# EAGLE design Laskuri (EAGLE 9.5.1)
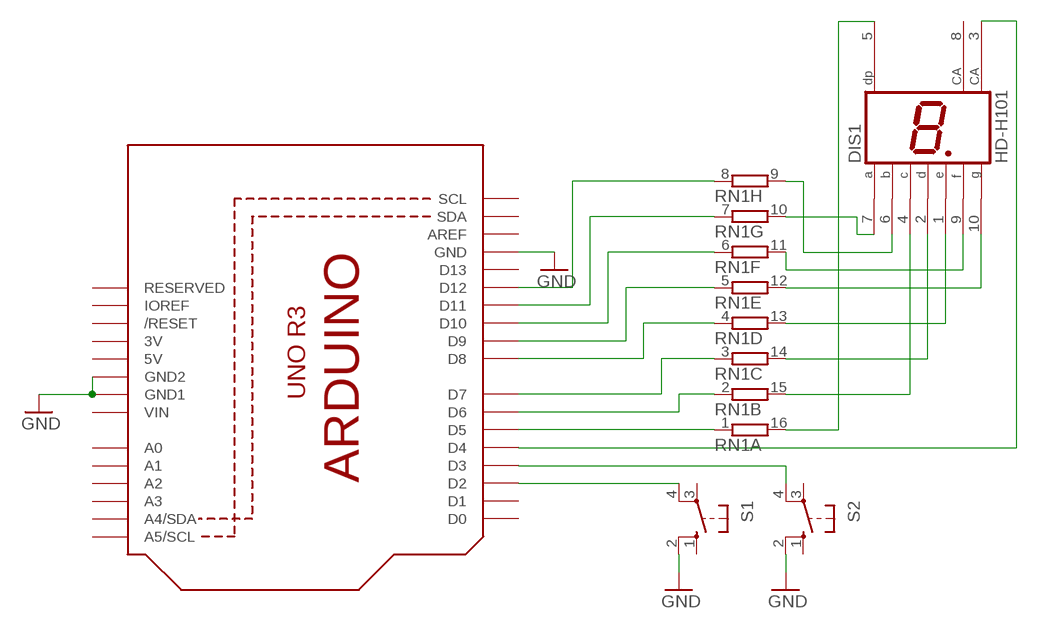
[diagram p0: schematic, sheet 1]

## Parts
DIS1  HD-H101  [HDSP-M]
RN1  8R-N  [DIL16]
S1  10-XX  [B3F-10XX]
S2  10-XX  [B3F-10XX]
U1  ARDUINOR3-DIMENSION  [ARDUINOR3]

## Nets
GND: S1.2(S1) S2.2(S1) U1.GND U1.GND1 U1.GND2
N$1: RN1.8 U1.D12
N$2: RN1.7 U1.D11
N$3: RN1.6 U1.D10
N$4: RN1.5 U1.D9
N$5: RN1.4 U1.D8
N$6: RN1.3 U1.D7
N$7: RN1.2 U1.D6
N$8: RN1.1 U1.D5
N$9: DIS1.1(E) RN1.13
N$10: S1.4(P1) U1.D2
N$11: S2.4(P1) U1.D3
N$12: DIS1.2(D) RN1.14
N$13: DIS1.4(C) RN1.15
N$14: DIS1.5(DP) RN1.16
N$15: DIS1.10(G) RN1.12
N$16: DIS1.9(F) RN1.11
N$17: DIS1.7(A) RN1.10
N$18: DIS1.6(B) RN1.9
N$19: DIS1.3(CA) U1.D4
Unconnected: DIS1.8(CA) S1.1(S) S1.3(P) S2.1(S) S2.3(P) U1.A0 U1.A1 U1.A2 U1.A3 U1.A4(A4/SDA) U1.A5(A5/SCL) U1.AREF U1.D0 U1.D1 U1.D13 U1.IOREF U1.RESERVED U1.RESET(/RESET) U1.SCL U1.SDA

## Power pins joined to a net without a drawn wire
3V: U1.3V
5V: U1.5V
VIN: U1.VIN

## Library data of the parts
DIS1 = display-hp:HD-H101: LED DISPLAY 1-character 7 segment, decimal point right; OC_FARNELL: unknown; OC_NEWARK: unknown
RN1 = resistor-dil:8R-N: DIL RESISTOR; OC_FARNELL: unknown; OC_NEWARK: unknown
S1 S2 = switch-omron:10-XX: OMRON SWITCH; MPN: B3F-1000; OC_FARNELL: 176432; OC_NEWARK: 36M3542
U1 = adafruit:ARDUINOR3: This is a new object for the new Arduino R3 - with extra pins that you may want to use (such as IOref, and duplicated A4/A5

## Net classes
0 default: width 1.016 mm, clearance 0.381 mm

## Board
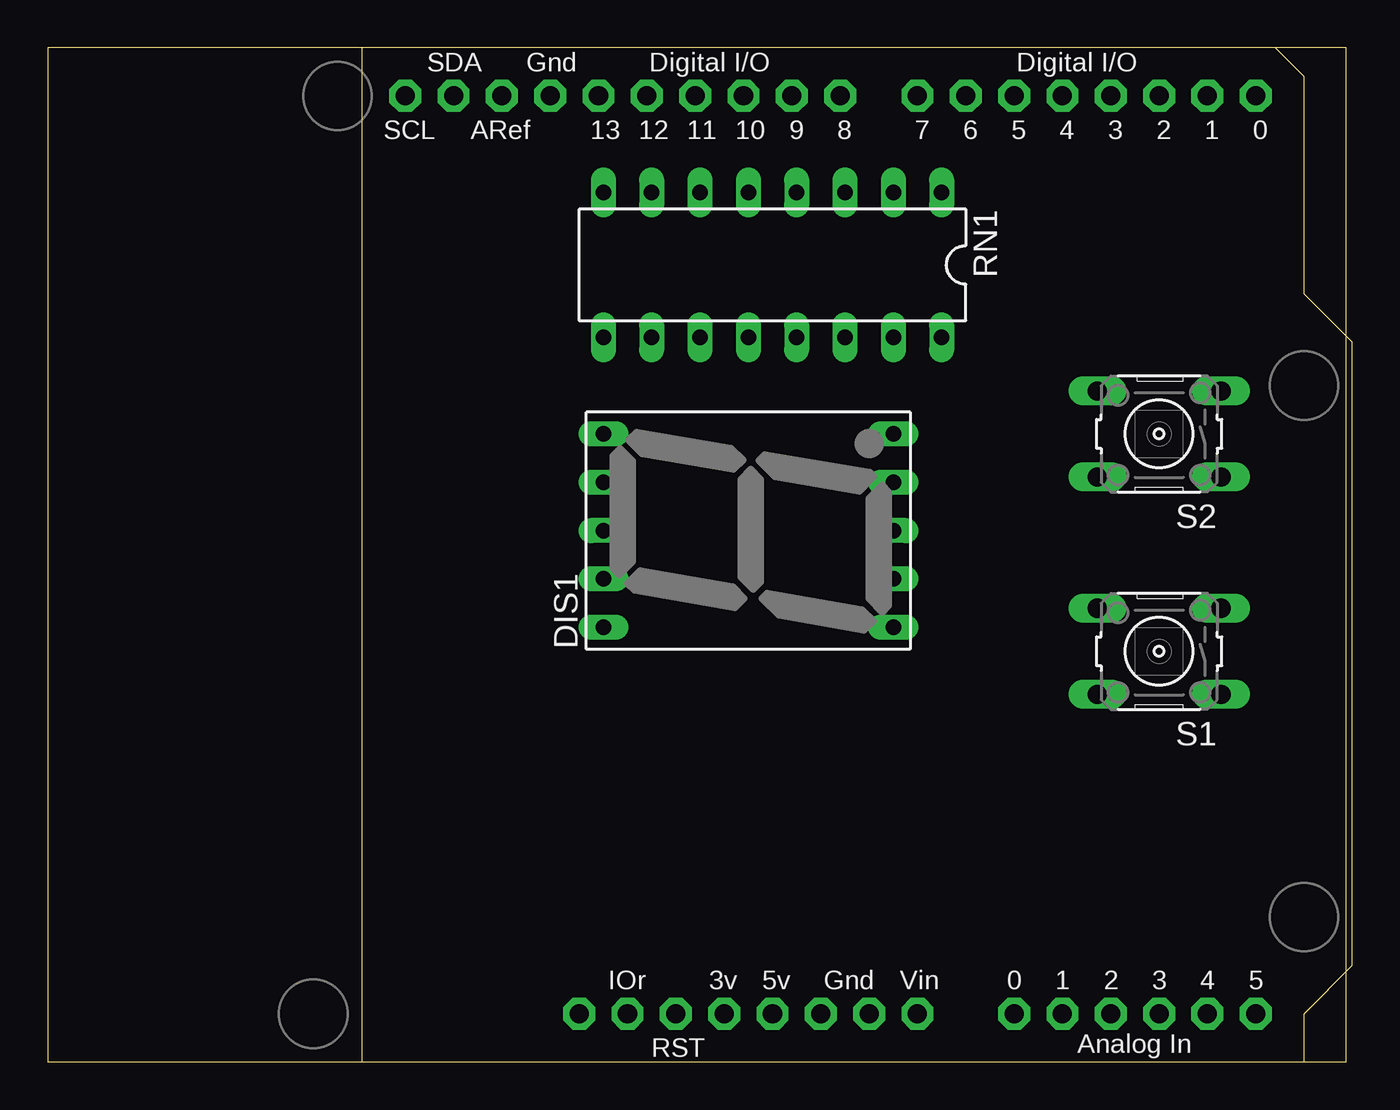
[diagram p1: board, top side]
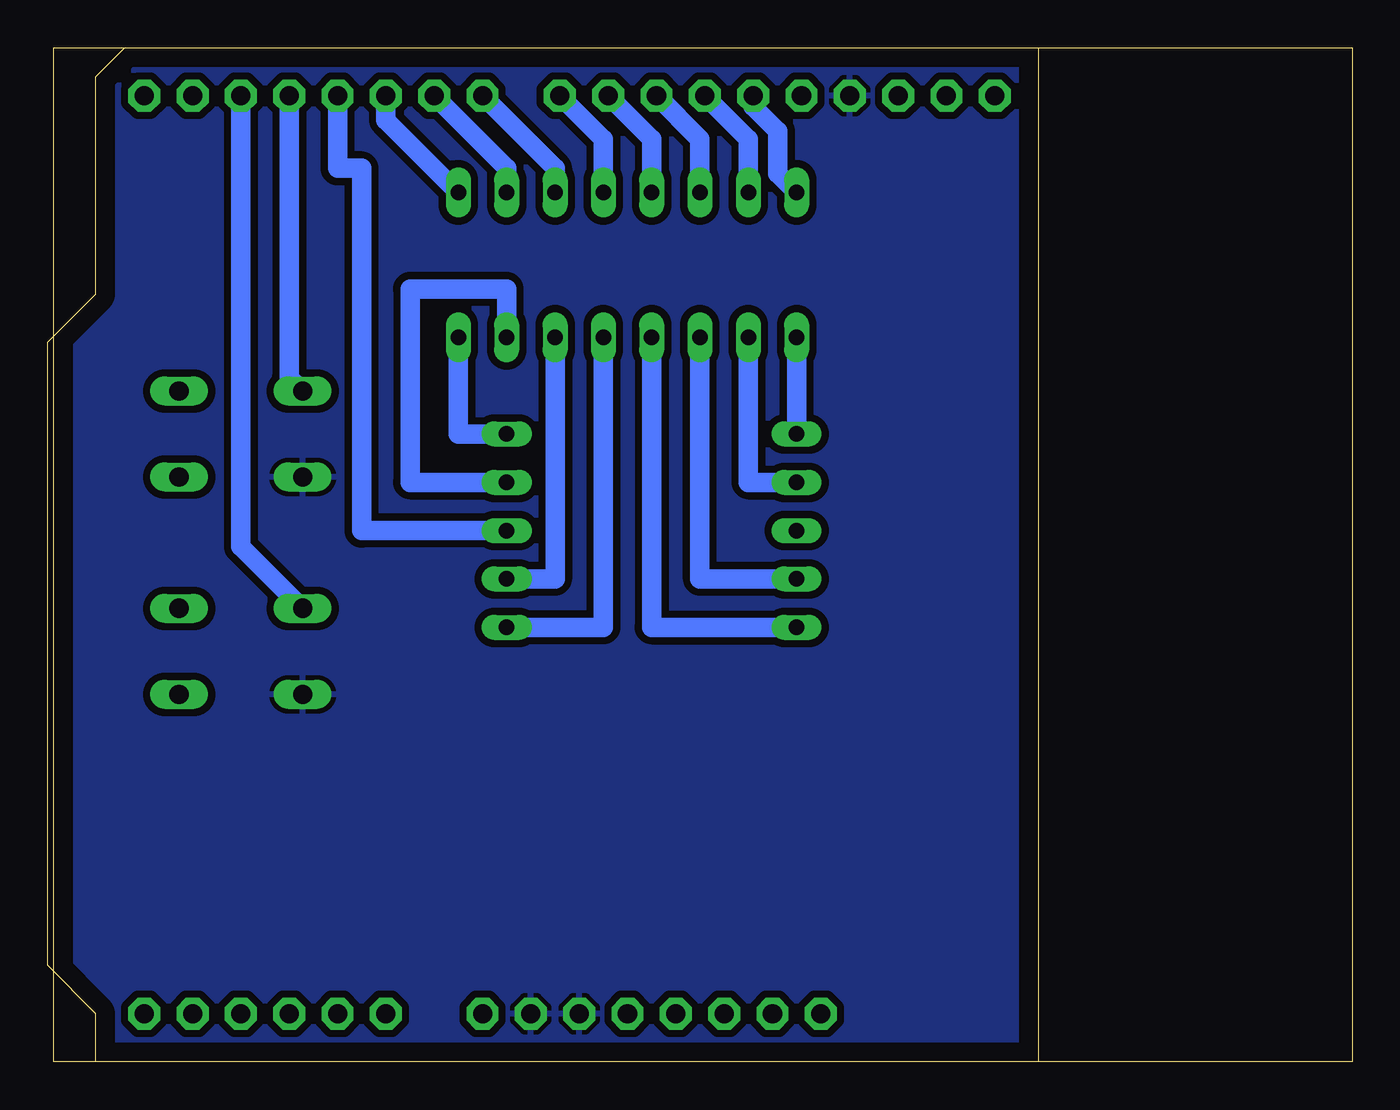
[diagram p2: board, bottom side, seen from below]

Size 51.74 x 53.33 mm. Coordinates in mm from the lower left corner, seen from the top.
Outline: 0,0 51.74,0 51.74,53.33 0,53.33 0,0
Copper layers (1*16): Top 0.035mm / dielectric 1.5mm / Bottom 0.035mm
Design rules "default": minimum track width 6mil, minimum drill 0.35mm, track to track 6mil, track to pad 6mil, pad to pad 6mil, via to via 6mil, smd to smd 6mil, copper to edge 40mil, drill to drill 6mil, minimum pad ring 10mil, minimum via ring 8mil, stop-mask expansion 4mil, vias tented up to drill 0mil, thermal gap 10mil

### Footprints (pad centres in the part's own frame; a part is rotated, then mirrored left to right if it is on the bottom)
HDSP-M = drill 0.813 long: 1 -5.08,-7.62; 2 -2.54,-7.62; 3 0,-7.62; 4 2.54,-7.62; 5 5.08,-7.62; 6 5.08,7.62; 7 2.54,7.62; 8 0,7.62; 9 -2.54,7.62; 10 -5.08,7.62
DIL16 = drill 0.813 long: 1 -8.89,-3.81; 2 -6.35,-3.81; 3 -3.81,-3.81; 4 -1.27,-3.81; 5 1.27,-3.81; 6 3.81,-3.81; 7 6.35,-3.81; 8 8.89,-3.81; 9 8.89,3.81; 10 6.35,3.81; 11 3.81,3.81; 12 1.27,3.81; 13 -1.27,3.81; 14 -3.81,3.81; 15 -6.35,3.81; 16 -8.89,3.81
B3F-10XX = drill 1.016 long: 1 -3.251,2.261; 2 3.251,2.261; 3 -3.251,-2.261; 4 3.251,-2.261
ARDUINOR3 = drill 1 pad 1.676 octagon: 3V 35.56,2.54; 5V 38.1,2.54; A0 50.8,2.54; A1 53.34,2.54; A2 55.88,2.54; A3 58.42,2.54; A4 60.96,2.54; A5 63.5,2.54; AREF 23.876,50.8; D0 63.5,50.8; D1 60.96,50.8; D2 58.42,50.8; D3 55.88,50.8; D4 53.34,50.8; D5 50.8,50.8; D6 48.26,50.8; D7 45.72,50.8; D8 41.656,50.8; D9 39.116,50.8; D10 36.576,50.8; D11 34.036,50.8; D12 31.496,50.8; D13 28.956,50.8; GND 26.416,50.8; GND1 43.18,2.54; GND2 40.64,2.54; IOREF 30.48,2.54; RESERVED 27.94,2.54; RESET 33.02,2.54; SCL 18.796,50.8; SDA 21.336,50.8; VIN 45.72,2.54

### Placement (x,y rotation side)
DIS1  20.32,27.94 90 top
RN1  21.59,41.91 180 top
S1  41.91,21.59 180 top
S2  41.91,33.02 180 top
U1  -16.51,0 0 top

### Tracks (layer width: path | path; a pad name or v marks a point on that pad's centre or on a via)
GND
  pour Bottom: 0,0 0,53.34 52.07,53.34 52.07,0
N$1
  Bottom 1.016: U1.D12 14.99,50.24 13.69,48.94 13.69,46.71 RN1.8
N$2
  Bottom 1.016: U1.D11 15.24,48.51 RN1.7
N$3
  Bottom 1.016: U1.D10 17.78,48.51 RN1.6
N$4
  Bottom 1.016: U1.D9 20.32,48.51 RN1.5
N$5
  Bottom 1.016: U1.D8 22.86,48.51 RN1.4
N$6
  Bottom 1.016: U1.D7 25.4,46.99 RN1.3
N$7
  Bottom 1.016: RN1.2 27.94,46.99 U1.D6
N$8
  Bottom 1.016: U1.D5 34.29,49.53 RN1.1
N$9
  Bottom 1.016: RN1.13 22.86,22.86 DIS1.1
N$10
  Bottom 1.016: U1.D2 41.91,27.1 S1.4
N$11
  Bottom 1.016: U1.D3 39.37,35.99 S2.4
N$12
  Bottom 1.016: RN1.14 25.4,25.4 DIS1.2
N$13
  Bottom 1.016: RN1.15 27.94,40.64 33.02,40.64 33.02,30.48 DIS1.4
N$14
  Bottom 1.016: RN1.16 30.48,33.02 DIS1.5
N$15
  Bottom 1.016: RN1.12 20.32,22.86 DIS1.10
N$16
  Bottom 1.016: DIS1.9 17.78,25.4 RN1.11
N$17
  Bottom 1.016: RN1.10 15.24,30.48 DIS1.7
N$18
  Bottom 1.016: DIS1.6 RN1.9
N$19
  Bottom 1.016: U1.D4 36.83,46.99 35.56,46.99 35.56,27.94 DIS1.3